# Altium schematic sheet LED_Matrix_Driver.SchDoc
size A3; SheetNumber: 5; SheetTotal: 5
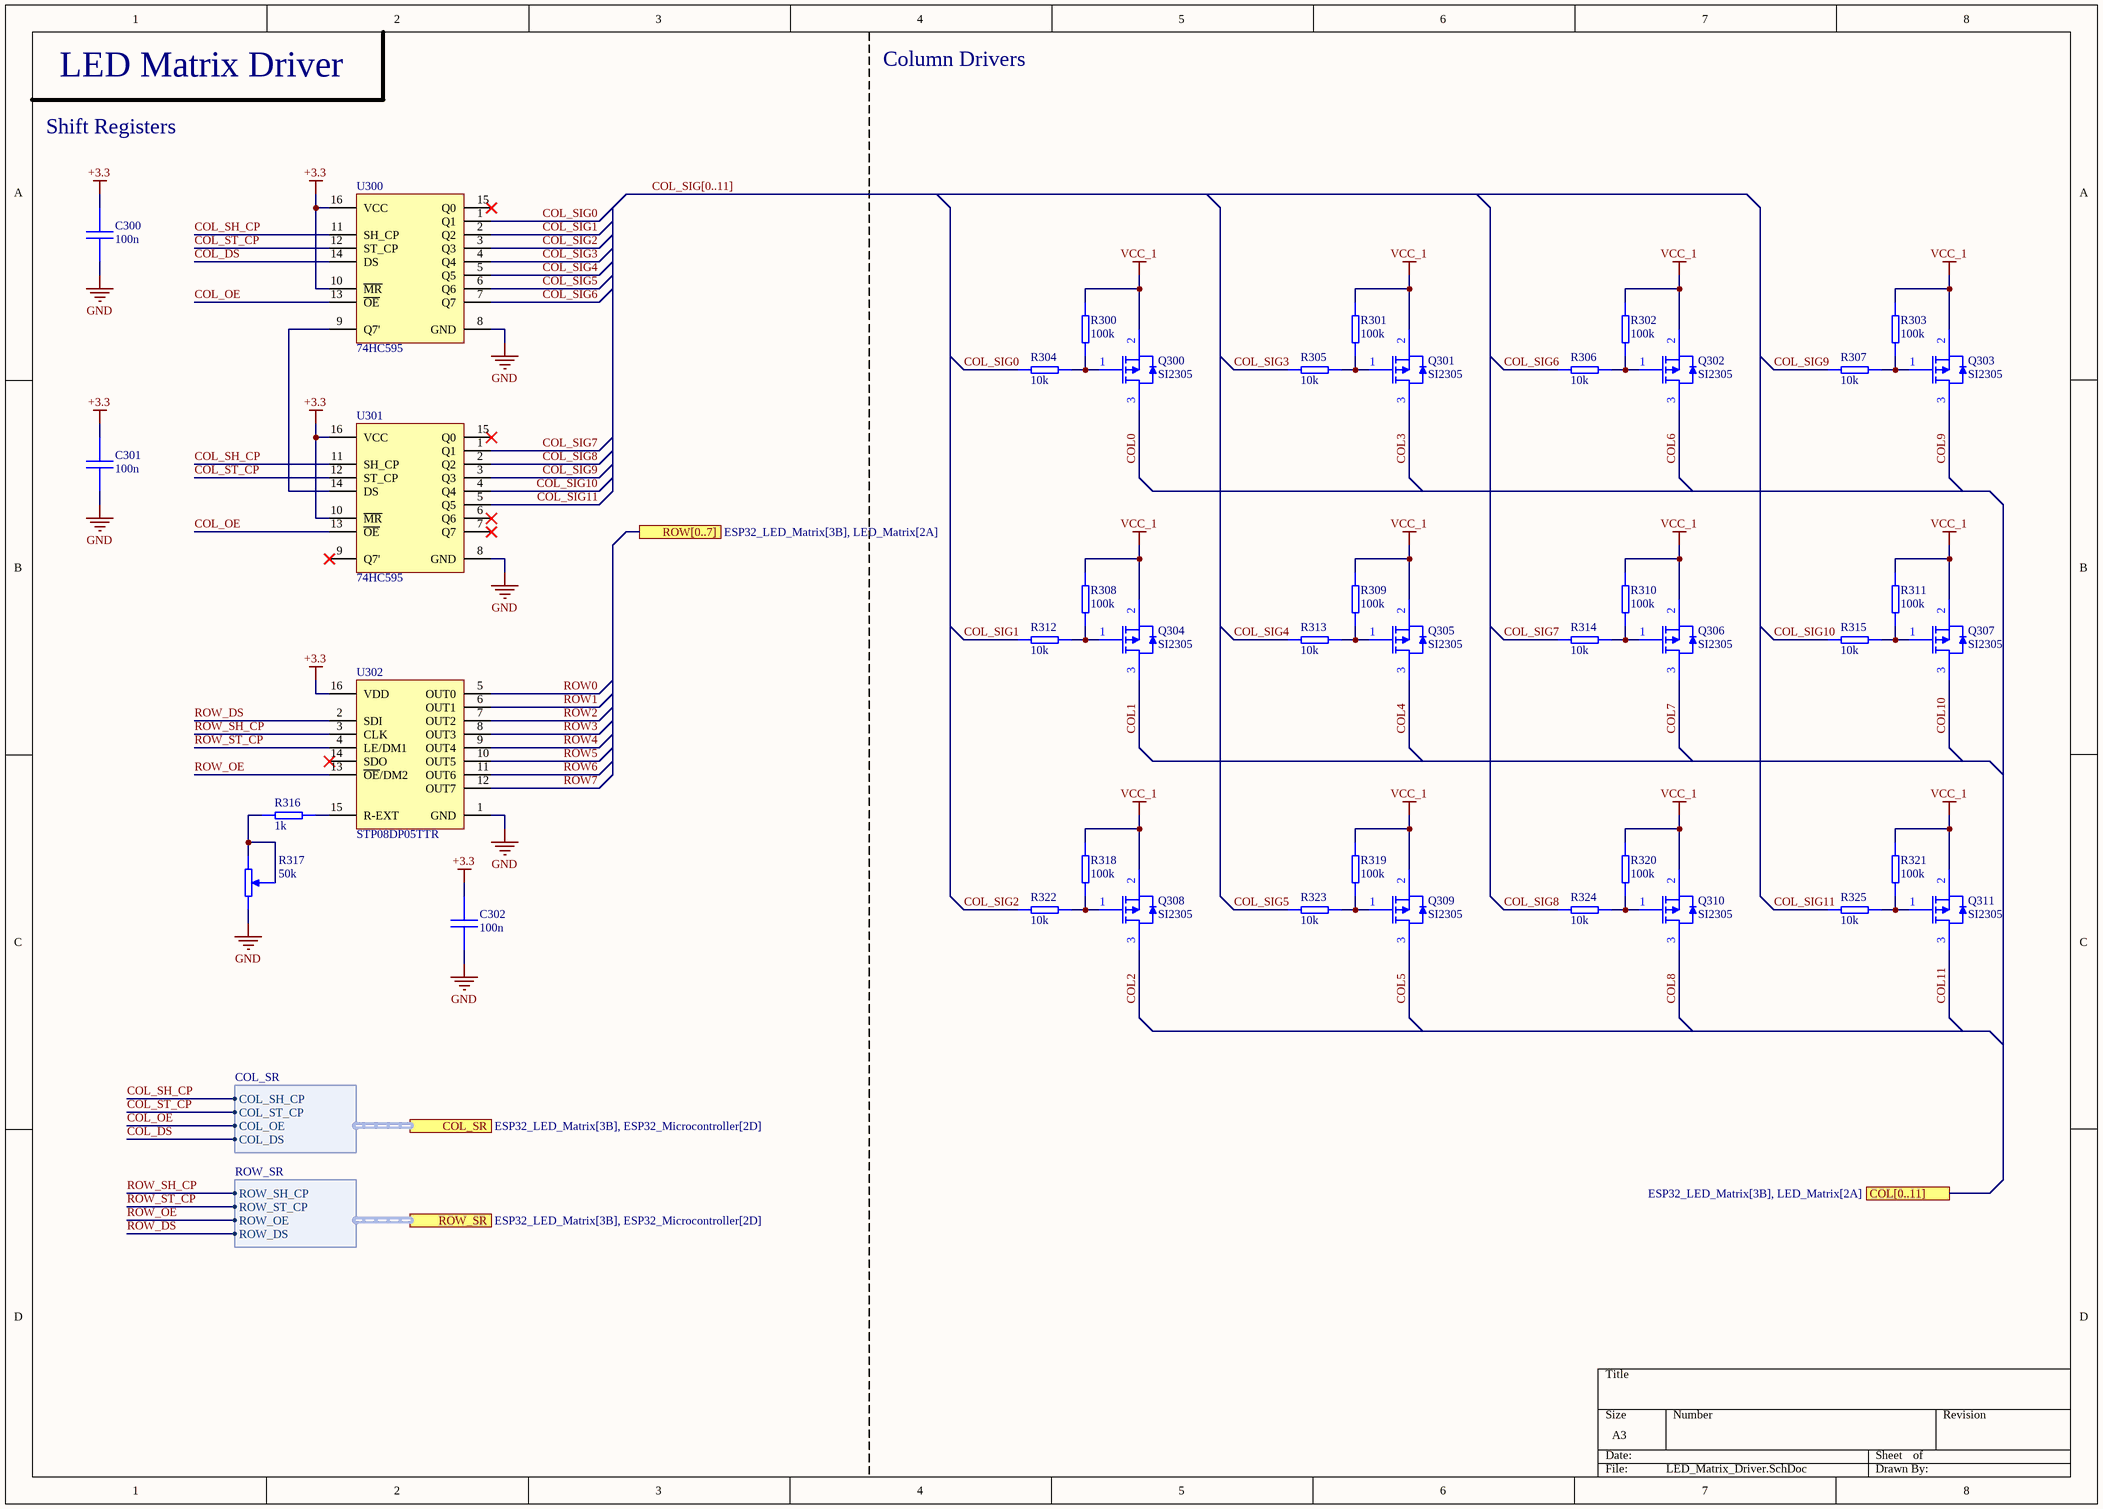
[diagram p0: LED_Matrix_Driver.SchDoc]

## Parts
C300  100n  [CAP0805]
C301  100n  [CAP0805]
C302  100n  [CAP0805]
Q300  SI2305  [SOT23]
Q301  SI2305  [SOT23]
Q302  SI2305  [SOT23]
Q303  SI2305  [SOT23]
Q304  SI2305  [SOT23]
Q305  SI2305  [SOT23]
Q306  SI2305  [SOT23]
Q307  SI2305  [SOT23]
Q308  SI2305  [SOT23]
Q309  SI2305  [SOT23]
Q310  SI2305  [SOT23]
Q311  SI2305  [SOT23]
R300  100k  [RESC0805]
R301  100k  [RESC0805]
R302  100k  [RESC0805]
R303  100k  [RESC0805]
R304  10k  [RESC0805]
R305  10k  [RESC0805]
R306  10k  [RESC0805]
R307  10k  [RESC0805]
R308  100k  [RESC0805]
R309  100k  [RESC0805]
R310  100k  [RESC0805]
R311  100k  [RESC0805]
R312  10k  [RESC0805]
R313  10k  [RESC0805]
R314  10k  [RESC0805]
R315  10k  [RESC0805]
R316  1k  [RESC0805]
R317  50k  [3339P1103LF]
R318  100k  [RESC0805]
R319  100k  [RESC0805]
R320  100k  [RESC0805]
R321  100k  [RESC0805]
R322  10k  [RESC0805]
R323  10k  [RESC0805]
R324  10k  [RESC0805]
R325  10k  [RESC0805]
U300  74HC595  [TSSOP16]
U301  74HC595  [TSSOP16]
U302  STP08DP05TTR  [TSSOP16]

## Ports
COL[0..11] (see ESP32_LED_Matrix[3B], LED_Matrix[2A]), COL_SR (harness COL_SR, see ESP32_LED_Matrix[3B], ESP32_Microcontroller[2D]), ROW[0..7] (see ESP32_LED_Matrix[3B], LED_Matrix[2A]), ROW_SR (harness ROW_SR, see ESP32_LED_Matrix[3B], ESP32_Microcontroller[2D])

## Harnesses
COL_SR: COL_SH_CP, COL_ST_CP, COL_OE, COL_DS
ROW_SR: ROW_SH_CP, ROW_ST_CP, ROW_OE, ROW_DS

## Nets
+3.3: C300.1 C301.1 C302.1 U300.10(~{MR}) U300.16(VCC) U301.10(~{MR}) U301.16(VCC) U302.16(VDD)
GND: C300.2 C301.2 C302.2 R317.3 U300.8(GND) U301.8(GND) U302.1(GND)
VCC_1: Q300.2(S) Q301.2(S) Q302.2(S) Q303.2(S) Q304.2(S) Q305.2(S) Q306.2(S) Q307.2(S) Q308.2(S) Q309.2(S) Q310.2(S) Q311.2(S) R300.1 R301.1 R302.1 R303.1 R308.1 R309.1 R310.1 R311.1 R318.1 R319.1 R320.1 R321.1
COL0: Q300.3(D)
COL1: Q304.3(D)
COL2: Q308.3(D)
COL3: Q301.3(D)
COL4: Q305.3(D)
COL5: Q309.3(D)
COL6: Q302.3(D)
COL7: Q306.3(D)
COL8: Q310.3(D)
COL9: Q303.3(D)
COL10: Q307.3(D)
COL11: Q311.3(D)
COL_DS: U300.14(DS) ; port COL_SR.COL_DS
COL_OE: U300.13(~{OE}) U301.13(~{OE}) ; port COL_SR.COL_OE
COL_SH_CP: U300.11(SH_CP) U301.11(SH_CP) ; port COL_SR.COL_SH_CP
COL_SIG0: R304.1 U300.1(Q1)
COL_SIG1: R312.1 U300.2(Q2)
COL_SIG2: R322.1 U300.3(Q3)
COL_SIG3: R305.1 U300.4(Q4)
COL_SIG4: R313.1 U300.5(Q5)
COL_SIG5: R323.1 U300.6(Q6)
COL_SIG6: R306.1 U300.7(Q7)
COL_SIG7: R314.1 U301.1(Q1)
COL_SIG8: R324.1 U301.2(Q2)
COL_SIG9: R307.1 U301.3(Q3)
COL_SIG10: R315.1 U301.4(Q4)
COL_SIG11: R325.1 U301.5(Q5)
COL_ST_CP: U300.12(ST_CP) U301.12(ST_CP) ; port COL_SR.COL_ST_CP
ROW0: U302.5(OUT0)
ROW1: U302.6(OUT1)
ROW2: U302.7(OUT2)
ROW3: U302.8(OUT3)
ROW4: U302.9(OUT4)
ROW5: U302.10(OUT5)
ROW6: U302.11(OUT6)
ROW7: U302.12(OUT7)
ROW_DS: U302.2(SDI) ; port ROW_SR.ROW_DS
ROW_OE: U302.13(~{OE}/DM2) ; port ROW_SR.ROW_OE
ROW_SH_CP: U302.3(CLK) ; port ROW_SR.ROW_SH_CP
ROW_ST_CP: U302.4(LE/DM1) ; port ROW_SR.ROW_ST_CP
NetQ300_1: Q300.1(G) R300.2 R304.2
NetQ301_1: Q301.1(G) R301.2 R305.2
NetQ302_1: Q302.1(G) R302.2 R306.2
NetQ303_1: Q303.1(G) R303.2 R307.2
NetQ304_1: Q304.1(G) R308.2 R312.2
NetQ305_1: Q305.1(G) R309.2 R313.2
NetQ306_1: Q306.1(G) R310.2 R314.2
NetQ307_1: Q307.1(G) R311.2 R315.2
NetQ308_1: Q308.1(G) R318.2 R322.2
NetQ309_1: Q309.1(G) R319.2 R323.2
NetQ310_1: Q310.1(G) R320.2 R324.2
NetQ311_1: Q311.1(G) R321.2 R325.2
NetR316_1: R316.1 U302.15(R-EXT)
NetR316_2: R316.2 R317.1 R317.2
NetU300_9: U300.9(Q7') U301.14(DS)

Not connected (* = marked no-connect by the designer): U300 15(Q0)*; U301 6(Q6)* 7(Q7)* 9(Q7')* 15(Q0)*; U302 14(SDO)*

## Buses and harness runs
bus COL_SIG[0..11]

## Notes on the sheet
- LED Matrix Driver
- Column Drivers
- Shift Registers

## Library data of the parts
C300-C302 = Capacitor - Non Polarized: Non Polarized Capacitor
Q300-Q311 = SI2305: General Purpose P-Channel MOSFET; ComponentLink1Description: Datasheet; ComponentLink1URL: https://www.vishay.com/docs/64847/si2305cd.pdf
R300-R316 R318-R325 = Resistor
R317 = Potentiometer: Potentionmeter
U300 U301 = 74HC595: Shift Register
U302 = STP08DP05TTR: LED Driver; Manufacturer_Name: STMicroelectronics; Datasheet Link: https://componentsearchengine.com/Datasheets/2/STP08DP05TTR.pdf; Height: 1.2mm; Manufacturer_Part_Number: STP08DP05TTR; Mouser Part Number: 511-STP08DP05TTR; Mouser Price/Stock: https://www.mouser.co.uk/ProductDetail/STMicroelectronics/STP08DP05TTR?qs=xgiOkRdDJ0m7T%2FaY25F5vQ%3D%3D; Arrow Part Number: STP08DP05TTR; Arrow Price/Stock: https://www.arrow.com/en/products/stp08dp05ttr/stmicroelectronics?region=nac